# Altium schematic sheet top_level.SchDoc
size A4
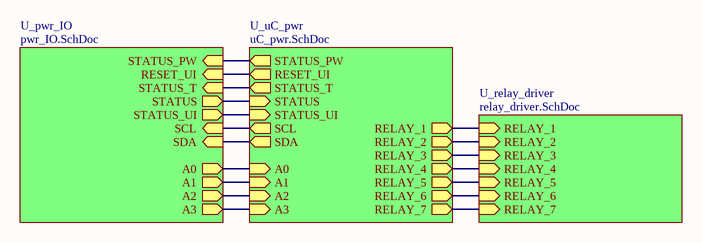
[diagram p0: top_level.SchDoc]

## Sub-sheets
U_pwr_IO = pwr_IO.SchDoc: STATUS_PW (in), STATUS_UI (out), RESET_UI (in), STATUS_T (in), STATUS (out), A2 (out), A3 (out), A0 (out), A1 (out), SCL (in), SDA (in)
U_relay_driver = relay_driver.SchDoc: RELAY_6 (in), RELAY_5 (in), RELAY_7 (in), RELAY_3 (in), RELAY_2 (in), RELAY_1 (in), RELAY_4 (in)
U_uC_pwr = uC_pwr.SchDoc: A0 (in), A1 (in), A2 (in), A3 (in), SCL (out), SDA (out), STATUS_PW (out), STATUS_UI (in), RESET_UI (out), STATUS_T (out), STATUS (in), RELAY_1 (out), RELAY_2 (out), RELAY_3 (out), RELAY_4 (out), RELAY_5 (out), RELAY_6 (out), RELAY_7 (out)

## Nets
(unnamed): sheet U_pwr_IO/STATUS_PW, sheet U_uC_pwr/STATUS_PW
(unnamed): sheet U_pwr_IO/STATUS_UI, sheet U_uC_pwr/STATUS_UI
(unnamed): sheet U_pwr_IO/RESET_UI, sheet U_uC_pwr/RESET_UI
(unnamed): sheet U_pwr_IO/STATUS_T, sheet U_uC_pwr/STATUS_T
(unnamed): sheet U_pwr_IO/STATUS, sheet U_uC_pwr/STATUS
(unnamed): sheet U_pwr_IO/A2, sheet U_uC_pwr/A2
(unnamed): sheet U_pwr_IO/A3, sheet U_uC_pwr/A3
(unnamed): sheet U_pwr_IO/A0, sheet U_uC_pwr/A0
(unnamed): sheet U_pwr_IO/A1, sheet U_uC_pwr/A1
(unnamed): sheet U_pwr_IO/SCL, sheet U_uC_pwr/SCL
(unnamed): sheet U_pwr_IO/SDA, sheet U_uC_pwr/SDA
(unnamed): sheet U_relay_driver/RELAY_6, sheet U_uC_pwr/RELAY_6
(unnamed): sheet U_relay_driver/RELAY_5, sheet U_uC_pwr/RELAY_5
(unnamed): sheet U_relay_driver/RELAY_7, sheet U_uC_pwr/RELAY_7
(unnamed): sheet U_relay_driver/RELAY_3, sheet U_uC_pwr/RELAY_3
(unnamed): sheet U_relay_driver/RELAY_2, sheet U_uC_pwr/RELAY_2
(unnamed): sheet U_relay_driver/RELAY_1, sheet U_uC_pwr/RELAY_1
(unnamed): sheet U_relay_driver/RELAY_4, sheet U_uC_pwr/RELAY_4